# EasyEDA schematic 2 Antenna Mini-Whip (TH)_ Power feed unit.json
TITLE: Antenna Mini-Whip (TH): Power feed unit; REV: 2.5.EE; Date: 2018-03-02; Sheet: 1/1; Drawn By: IgrikXD
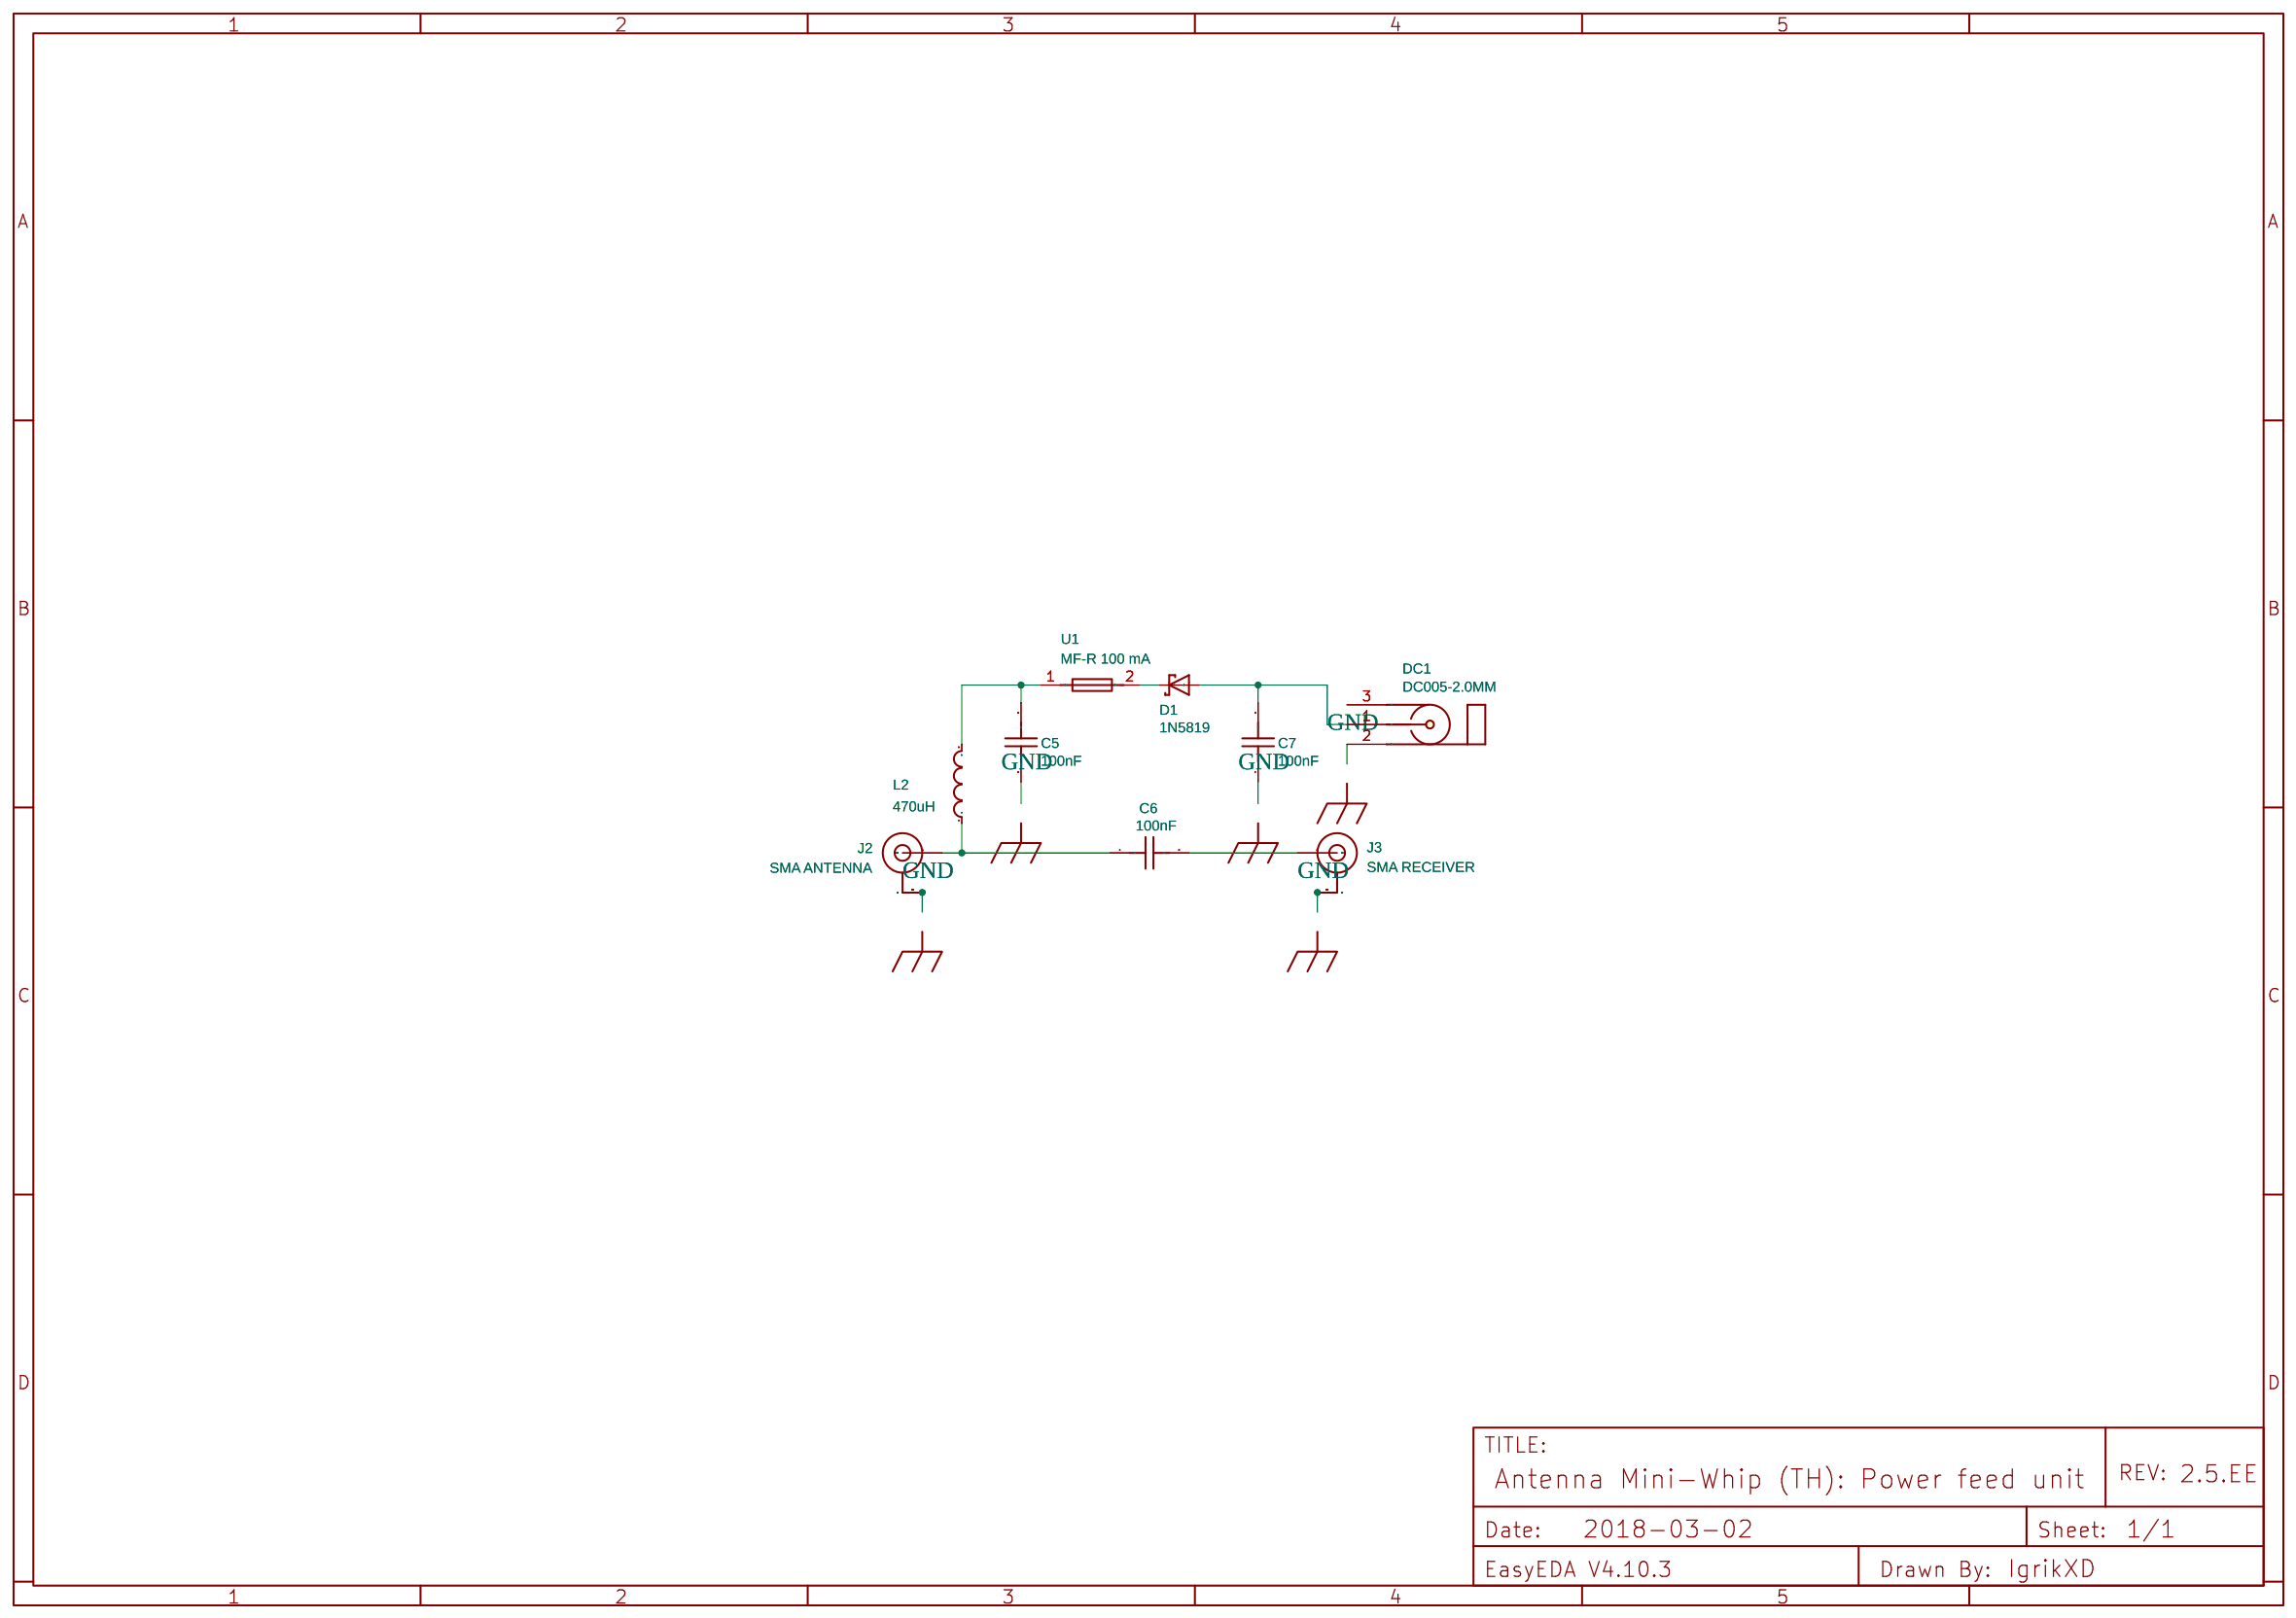
[diagram p0: schematic sheet]

## Parts
C5  100nF  [RAD-0.1]
C6  100nF  [RAD-0.1]
C7  100nF  [RAD-0.1]
D1  1N5819  [DO41-7]
DC1  DC005-2.0MM  [DC-5020]
J2  SMA ANTENNA  [SMA-EDGE]
J3  SMA RECEIVER  [SMA-EDGE]
L2  470uH  [AXIAL-0.4]
U1  MF-R 100 mA  [F-0.10A-60V]

## Library data of the parts
C5-C7 = Capacitor: Manufacturer Part: Monolithic0805B104J500F3; Supplier: LCSC; LCSC: C110282; Manufacturer: FH
D1 = -: catid: 20; Contributor: Adafruit; Supplier: LCSC; LCSC: C110032; Manufacturer: STMicroelectronics
DC1 = -: Supplier: LCSC; Manufacturer: BOOMELE; Manufacturer Part: DC-005 5.5-2.0MM; LCSC: C16214
J2 J3 = -: SMA Antenna Connector; catid: 20; Contributor: Pinoccio; Manufacturer Part: CON-SMA-EDGE-S; Supplier: Digi-Key; Digi-Key: CON-SMA-EDGE-S-ND; Manufacturer: RF Solutions
L2 = Inductor: Manufacturer Part: LGA0510-471KP52E; Supplier: LCSC; LCSC: C72362; Manufacturer: FH
U1 = -: Supplier: LCSC; Manufacturer: BOURNS; Manufacturer Part: MF-R010-0-99; LCSC: C89660

## Nets
GND: C5.1 C7.1 DC1.2 J2.GND@0(GND) J2.GND@1(GND) J2.GND@2(GND) J2.GND@3(GND) J3.GND@0(GND) J3.GND@1(GND) J3.GND@2(GND) J3.GND@3(GND)
Net-(C5-2): C5.2 L2.2 U1.1
Net-(C6-1): C6.1 J2.SIG(SIGNAL) L2.1
Net-(C6-2): C6.2 J3.SIG(SIGNAL)
Net-(C7-2): C7.2 D1.A DC1.1(VCC)
Net-(D1-C): D1.C U1.2

Not connected (* = marked no-connect by the designer): DC1 3
